# Altium schematic sheet APP_1_Hiearchic.SchDoc
size Tabloid; SheetNumber: 3; SheetTotal: 14; Sheet_Name: Hierarchic; Size: 11x17
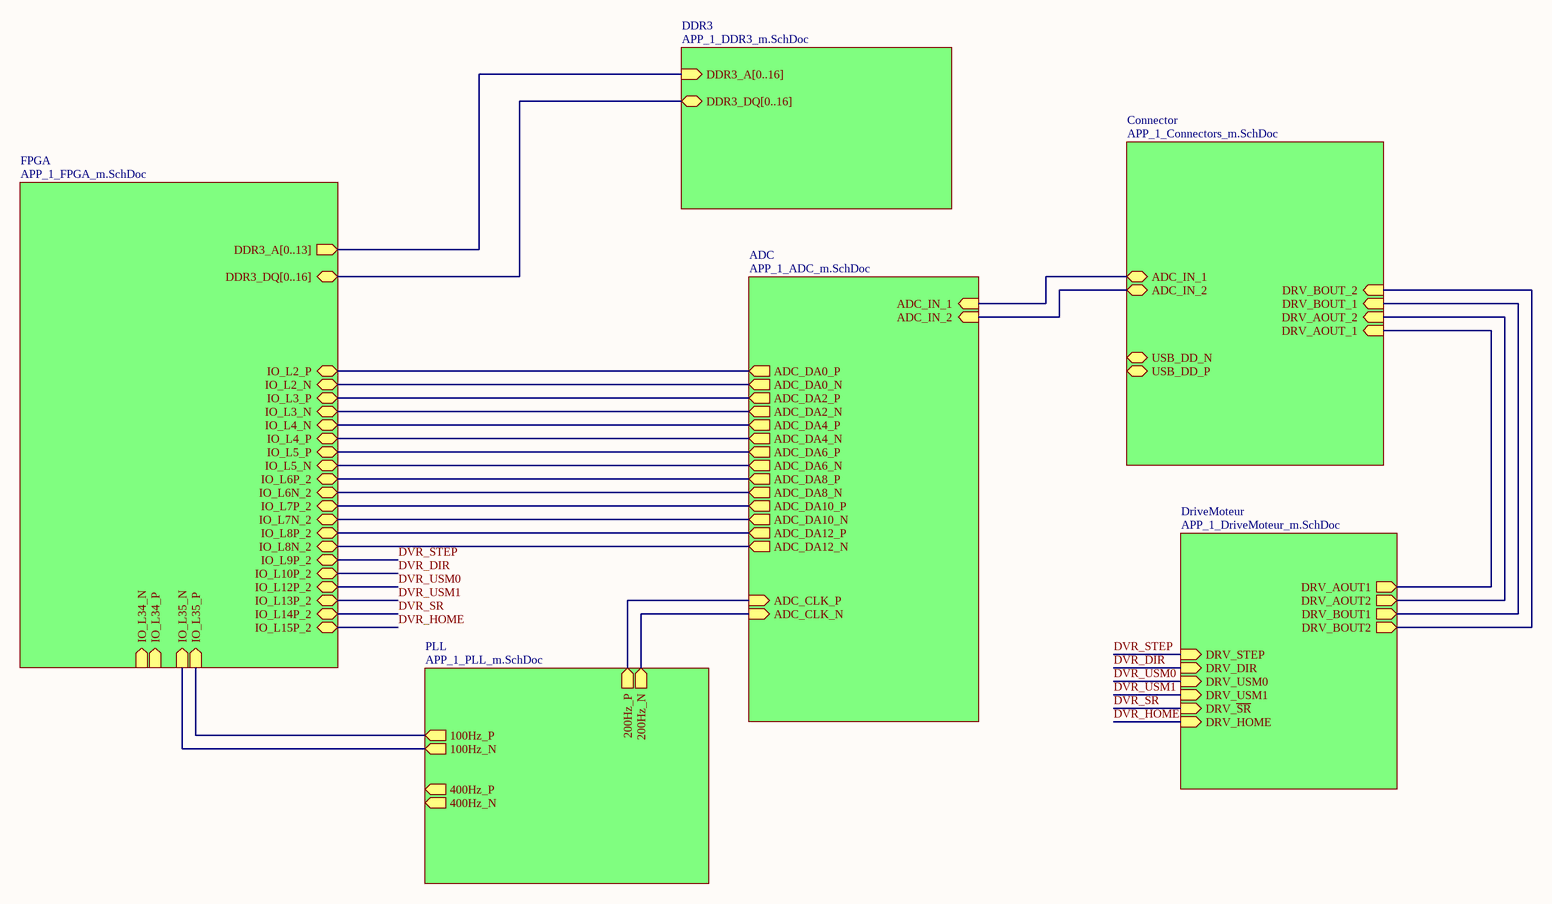
[diagram p0: APP_1_Hiearchic.SchDoc]

## Sub-sheets
ADC = APP_1_ADC_m.SchDoc: ADC_IN_1 (in), ADC_IN_2 (in), ADC_CLK_P (in), ADC_CLK_N (in), ADC_DA0_P (out), ADC_DA0_N (out), ADC_DA2_P (out), ADC_DA2_N (out), ADC_DA4_P (out), ADC_DA4_N (out), ADC_DA6_P (out), ADC_DA6_N (out), ADC_DA8_P (out), ADC_DA8_N (out), ADC_DA10_P (out), ADC_DA10_N (out), ADC_DA12_P (out), ADC_DA12_N (out)
Connector = APP_1_Connectors_m.SchDoc: ADC_IN_1 (bidir), ADC_IN_2 (bidir), DRV_AOUT_1 (in), DRV_AOUT_2 (in), DRV_BOUT_1 (in), DRV_BOUT_2 (in), USB_DD_P (bidir), USB_DD_N (bidir)
DDR3 = APP_1_DDR3_m.SchDoc: DDR3_A[0..16] (in), DDR3_DQ[0..16] (bidir)
DriveMoteur = APP_1_DriveMoteur_m.SchDoc: DRV_AOUT1 (out), DRV_AOUT2 (out), DRV_BOUT1 (out), DRV_BOUT2 (out), DRV_STEP (in), DRV_DIR (in), DRV_USM0 (in), DRV_USM1 (in), DRV_~{SR} (in), DRV_HOME (in)
FPGA = APP_1_FPGA_m.SchDoc: DDR3_A[0..13] (out), DDR3_DQ[0..16] (bidir), IO_L34_N (in), IO_L34_P (in), IO_L35_P (in), IO_L35_N (in), IO_L2_P (bidir), IO_L2_N (bidir), IO_L3_P (bidir), IO_L3_N (bidir), IO_L4_N (bidir), IO_L4_P (bidir), IO_L5_P (bidir), IO_L5_N (bidir), IO_L6P_2 (bidir), IO_L6N_2 (bidir), IO_L7P_2 (bidir), IO_L7N_2 (bidir), IO_L8P_2 (bidir), IO_L8N_2 (bidir), IO_L9P_2 (bidir), IO_L10P_2 (bidir), IO_L12P_2 (bidir), IO_L13P_2 (bidir), IO_L14P_2 (bidir), IO_L15P_2 (bidir)
PLL = APP_1_PLL_m.SchDoc: 100Hz_P (out), 100Hz_N (out), 200Hz_P (out), 200Hz_N (out), 400Hz_P (out), 400Hz_N (out)

## Nets
DVR_DIR: sheet FPGA/IO_L10P_2, sheet DriveMoteur/DRV_DIR
DVR_HOME: sheet FPGA/IO_L15P_2, sheet DriveMoteur/DRV_HOME
DVR_SR: sheet FPGA/IO_L14P_2, sheet DriveMoteur/DRV_~{SR}
DVR_STEP: sheet FPGA/IO_L9P_2, sheet DriveMoteur/DRV_STEP
DVR_USM0: sheet FPGA/IO_L12P_2, sheet DriveMoteur/DRV_USM0
DVR_USM1: sheet FPGA/IO_L13P_2, sheet DriveMoteur/DRV_USM1
(unnamed): sheet FPGA/IO_L35_P, sheet PLL/100Hz_P
(unnamed): sheet FPGA/IO_L35_N, sheet PLL/100Hz_N
(unnamed): sheet FPGA/IO_L2_P, sheet ADC/ADC_DA0_P
(unnamed): sheet FPGA/IO_L2_N, sheet ADC/ADC_DA0_N
(unnamed): sheet FPGA/IO_L3_P, sheet ADC/ADC_DA2_P
(unnamed): sheet FPGA/IO_L3_N, sheet ADC/ADC_DA2_N
(unnamed): sheet FPGA/IO_L4_N, sheet ADC/ADC_DA4_P
(unnamed): sheet FPGA/IO_L4_P, sheet ADC/ADC_DA4_N
(unnamed): sheet FPGA/IO_L5_P, sheet ADC/ADC_DA6_P
(unnamed): sheet FPGA/IO_L5_N, sheet ADC/ADC_DA6_N
(unnamed): sheet FPGA/IO_L6P_2, sheet ADC/ADC_DA8_P
(unnamed): sheet FPGA/IO_L6N_2, sheet ADC/ADC_DA8_N
(unnamed): sheet FPGA/IO_L7P_2, sheet ADC/ADC_DA10_P
(unnamed): sheet FPGA/IO_L7N_2, sheet ADC/ADC_DA10_N
(unnamed): sheet FPGA/IO_L8P_2, sheet ADC/ADC_DA12_P
(unnamed): sheet FPGA/IO_L8N_2, sheet ADC/ADC_DA12_N
(unnamed): sheet PLL/200Hz_P, sheet ADC/ADC_CLK_P
(unnamed): sheet PLL/200Hz_N, sheet ADC/ADC_CLK_N
(unnamed): sheet ADC/ADC_IN_1, sheet Connector/ADC_IN_1
(unnamed): sheet ADC/ADC_IN_2, sheet Connector/ADC_IN_2
(unnamed): sheet Connector/DRV_AOUT_1, sheet DriveMoteur/DRV_AOUT1
(unnamed): sheet Connector/DRV_AOUT_2, sheet DriveMoteur/DRV_AOUT2
(unnamed): sheet Connector/DRV_BOUT_1, sheet DriveMoteur/DRV_BOUT1
(unnamed): sheet Connector/DRV_BOUT_2, sheet DriveMoteur/DRV_BOUT2

## Buses and harness runs
bus sheet DDR3/DDR3_A[0..16] = sheet FPGA/DDR3_A[0..13]
bus sheet DDR3/DDR3_DQ[0..16] = sheet FPGA/DDR3_DQ[0..16]

## Notes on the sheet
- Sheet Name
- Project Title
- Global Project
- Size
- Group
- Revision
- Date
- Sheet
- of
- Filename
- Designers